# EAGLE design GPS_radiologger_v14 (EAGLE 9.5.1)
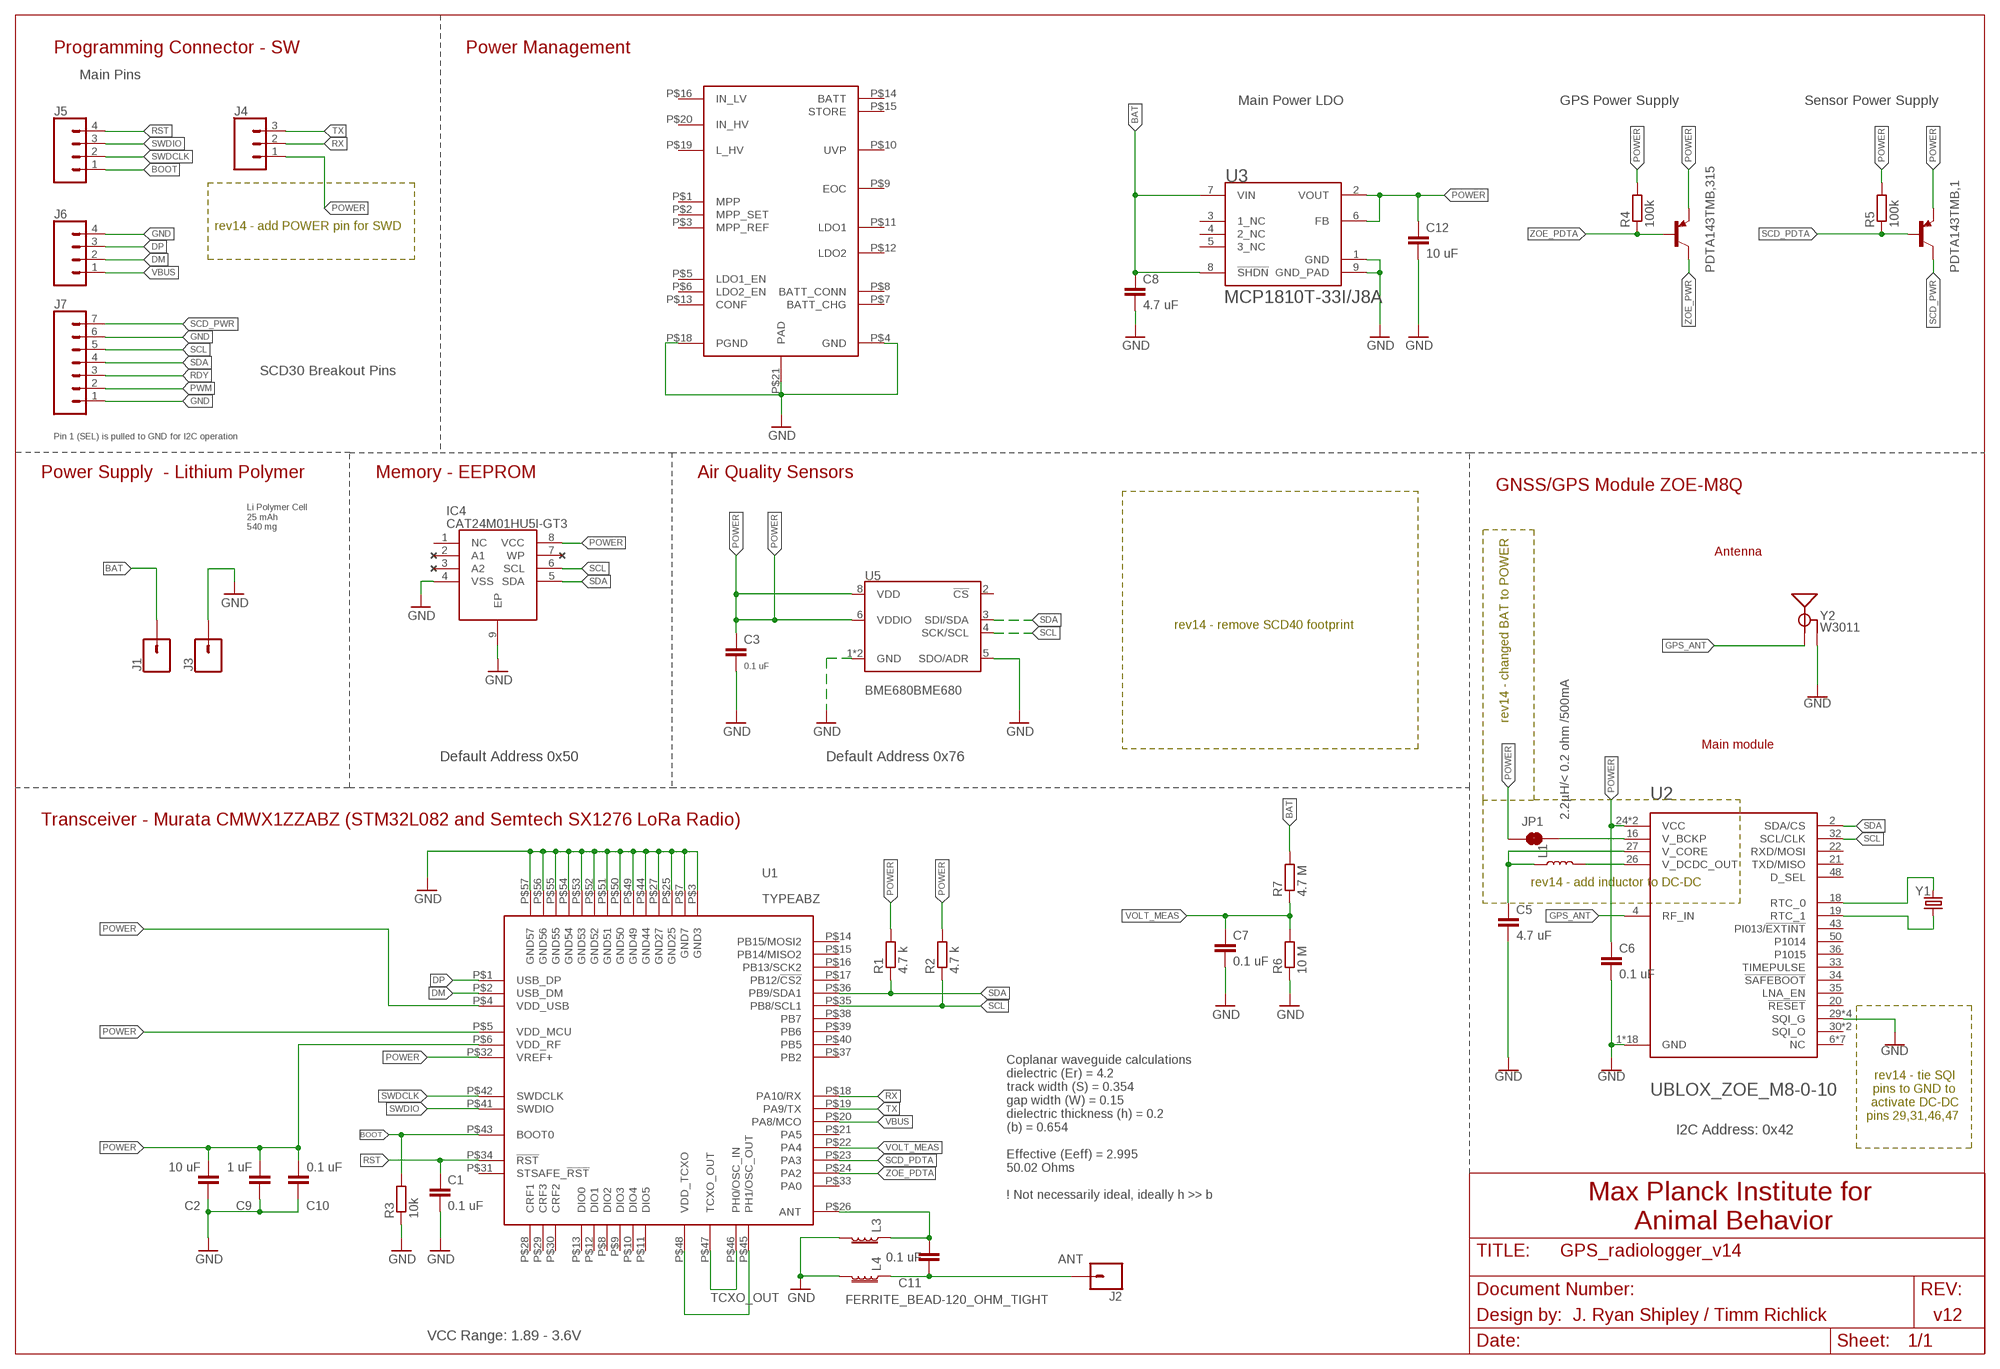
[diagram p0: schematic, sheet 1]

## Parts
C1  0.1 uF  C-EUC0201  [C0201]
C2  10 uF  C-EUC0201  [C0201]
C3  0.1 uF  C-EUC0201  [C0201]
C5  4.7 uF  C-EUC0201  [C0201]
C6  0.1 uF  C-EUC0201  [C0201]
C7  0.1 uF  C-EUC0201  [C0201]
C8  4.7 uF  C-EUC0201  [C0201]
C9  1 uF  C-EUC0201  [C0201]
C10  0.1 uF  C-EUC0201  [C0201]
C11  0.1 uF  C-EUC0201  [C0201]
C12  10 uF  C-EUC0201  [C0201]
IC4  CAT24M01HU5I-GT3  [SON50P300X200X55-9N]
J1  CONN_01PTH_NO_SILK_YES_STOP  [1X01_NO_SILK]
J2  CONN_01PTH_NO_SILK_SMALL  [1X01_SMALL]
J3  CONN_01PTH_NO_SILK_YES_STOP  [1X01_NO_SILK]
J4  CONN_031X03_1.27_NO_SILK  [1X03_1.27MM_NO_SILK]
J5  CONN_041.27MM_NO_SILK  [1X04_1.27MM_NO_SILK]
J6  CONN_041.27MM_NO_SILK  [1X04_1.27MM_NO_SILK]
J7  CONN_07NO_SILK  [1X07_NO_SILK]
JP1  JUMPER-SMT_2_NC_TRACE_NO-SILK  [SMT-JUMPER_2_NC_TRACE_NO-SILK]
L1  2.2µH/< 0.2 ohm /500mA  INDUCTOR-0805-3.3UH  [0805]
L3  FERRITE_BEAD-120_OHM_TIGHT  [0402-TIGHT]
L4  FERRITE_BEAD-120_OHM_TIGHT  [0402-TIGHT]
PDTA143TMB,1  TINYPICO-PNPAMB  [SOT883(B)]
PDTA143TMB,315  TINYPICO-PNPAMB  [SOT883(B)]
R1  4.7 k  R-EU_R0201  [R0201]
R2  4.7 k  R-EU_R0201  [R0201]
R3  10k  R-EU_R0201  [R0201]
R4  100k  R-EU_R0201  [R0201]
R5  100k  R-EU_R0201  [R0201]
R6  10 M  R-EU_R0201  [R0201]
R7  4.7 M  R-EU_R0201  [R0201]
U1  TYPEABZ  [TYPEABZ]
U2  UBLOX_ZOE_M8-0-10  [UBLOX_ZOE_M8-0-10]
U3  MICROCHIP_MCP1810T-33I-J8AMICROCHIP_MCP1810T-33I-J8A_0_0  [MICROCHIP_MCP1810T-33I-J8A_0]
U4  SPV1050  [SPV1050]
U5  BME680BME680  [LGA3.0X3.0]
Y1  32.768kHz  CRYSTAL-32.768KHZ  [CRYSTAL-SMD-1.0X1.2MM]
Y2  W3011  GPS_CHIP_ANTENNAW3011  [W3011]

## Nets
ANT: C11.1 J2.P$1 L4.1
BAT: C8.1 J1.1 R7.2 U3.7(VIN) U3.8(!SHDN!)
BOOT: J5.1 R3.2 U1.P$43(BOOT0)
DM: J6.2 U1.P$2(USB_DM)
DP: J6.3 U1.P$1(USB_DP)
GND: C1.2 C2.1 C3.2 C5.2 C6.2 C7.2 C8.2 C9.1 C10.1 C12.2 IC4.4(VSS) IC4.9(EP) J3.1 J6.4 J7.1 J7.6 L3.2 L4.2 R3.1 R6.1 U1.P$3(GND3) U1.P$7(GND7) U1.P$25(GND25) U1.P$27(GND27) U1.P$44(GND44) U1.P$49(GND49) U1.P$50(GND50) U1.P$51(GND51) U1.P$52(GND52) U1.P$53(GND53) U1.P$54(GND54) U1.P$55(GND55) U1.P$56(GND56) U1.P$57(GND57) U2.1(GND) U2.3(GND) U2.5(GND) U2.7(GND) U2.8(GND) U2.9(GND) U2.10(GND) U2.11(GND) U2.12(GND) U2.17(GND) U2.23(GND) U2.29(SQI_G) U2.31(SQI_G) U2.37(GND) U2.38(GND) U2.39(GND) U2.40(GND) U2.41(GND) U2.44(GND) U2.46(SQI_G) U2.47(SQI_G) U2.49(GND) U3.1(GND) U3.9(GND_PAD) U4.P$4(GND) U4.P$18(PGND) U4.P$21(PAD) U5.1(GND) U5.5(SDO/ADR) U5.7(GND) Y2.2(GND) Y2.3(GND)
GPS_ANT [antenna]: U2.4(RF_IN) Y2.1(SIGNAL)
N$1: U1.P$45(PH1/OSC_OUT) U1.P$48(VDD_TCXO)
N$2: JP1.2 U2.16(V_BCKP)
N$3: C5.1 L1.1 U2.27(V_CORE)
N$5: L1.2 U2.26(V_DCDC_OUT)
N$14: U2.18(RTC_0) Y1.P$2
N$15: U2.19(RTC_1) Y1.P$1
N$32: C11.2 L3.1 U1.P$26(ANT)
POWER: C2.2 C3.1 C6.1 C9.2 C10.2 C12.1 IC4.8(VCC) J4.1 JP1.1 PDTA143TMB,1.2(E) PDTA143TMB,315.2(E) R1.2 R2.2 R4.2 R5.2 U1.P$4(VDD_USB) U1.P$5(VDD_MCU) U1.P$6(VDD_RF) U1.P$32(VREF+) U2.24(VCC) U2.25(VCC) U3.2(VOUT) U3.6(FB) U5.6(VDDIO) U5.8(VDD)
PWM: J7.2
RDY: J7.3
RST: C1.1 J5.4 U1.P$34(!RST)
RX: J4.2 U1.P$18(PA10/RX)
SCD_PDTA: PDTA143TMB,1.1(B) R5.1 U1.P$23(PA3)
SCD_PWR: J7.7 PDTA143TMB,1.3(C)
SCL: IC4.6(SCL) J7.5 R2.1 U1.P$35(PB8/SCL1) U2.32(SCL/CLK) U5.4(SCK/SCL)
SDA: IC4.5(SDA) J7.4 R1.1 U1.P$36(PB9/SDA1) U2.2(SDA/CS) U5.3(SDI/SDA)
SWDCLK: J5.2 U1.P$42(SWDCLK)
SWDIO: J5.3 U1.P$41(SWDIO)
TCXO_OUT: U1.P$46(PH0/OSC_IN) U1.P$47(TCXO_OUT)
TX: J4.3 U1.P$19(PA9/TX)
VBUS: J6.1 U1.P$20(PA8/MCO)
VOLT_MEAS: C7.1 R6.2 R7.1 U1.P$22(PA4)
ZOE_PDTA: PDTA143TMB,315.1(B) R4.1 U1.P$24(PA2)
ZOE_PWR: PDTA143TMB,315.3(C)
Unconnected: IC4.1(NC) IC4.2(A1) IC4.3(A2) IC4.7(WP) U1.P$8(DIO2) U1.P$9(DIO3) U1.P$10(DIO4) U1.P$11(DIO5) U1.P$12(DIO1) U1.P$13(DIO0) U1.P$14(PB15/MOSI2) U1.P$15(PB14/MISO2) U1.P$16(PB13/SCK2) U1.P$17(PB12/!CS2) U1.P$21(PA5) U1.P$28(CRF1) U1.P$29(CRF3) U1.P$30(CRF2) U1.P$31(STSAFE_!RST) U1.P$33(PA0) U1.P$37(PB2) U1.P$38(PB7) U1.P$39(PB6) U1.P$40(PB5) U2.6(NC) U2.13(NC) U2.14(NC) U2.15(NC) U2.20(!RESET) U2.21(TXD/MISO) U2.22(RXD/MOSI) U2.28(NC) U2.30(SQI_O) U2.33(TIMEPULSE) U2.34(!SAFEBOOT) U2.35(LNA_EN) U2.36(P1015) U2.42(NC) U2.43(PI013/!EXTINT) U2.45(SQI_O) U2.48(D_SEL) U2.50(P1014) U2.51(NC) U3.3(1_NC) U3.4(2_NC) U3.5(3_NC) U4.P$1(MPP) U4.P$2(MPP_SET) U4.P$3(MPP_REF) U4.P$5(LDO1_EN) U4.P$6(LDO2_EN) U4.P$7(BATT_CHG) U4.P$8(BATT_CONN) U4.P$9(EOC) U4.P$10(UVP) U4.P$11(LDO1) U4.P$12(LDO2) U4.P$13(CONF) U4.P$14(BATT) U4.P$15(STORE) U5.2(!CS)

## Notes on the sheet
- Programming Connector - SW | Power Management
- Main Pins
- Main Power LDO | GPS Power Supply | Sensor Power Supply
- rev14 - add POWER pin for SWD
- SCD30 Breakout Pins
- Pin 1 (SEL) is pulled to GND for I2C operation
- Power Supply  - Lithium Polymer | Memory - EEPROM | Air Quality Sensors
- GNSS/GPS Module ZOE-M8Q
- Li Polymer Cell
  25 mAh
  540 mg
- Antenna
- rev14 - remove SCD40 footprint
- rev14 - changed BAT to POWER
- Main module
- Default Address 0x50 | Default Address 0x76
- Transceiver - Murata CMWX1ZZABZ (STM32L082 and Semtech SX1276 LoRa Radio)
- rev14 - add inductor to DC-DC
- rev14 - tie SQI 
  pins to GND to 
  activate DC-DC
  pins 29,31,46,47
- I2C Address: 0x42
- Coplanar waveguide calculations
  dielectric (Er) = 4.2
  track width (S) = 0.354
  gap width (W) = 0.15
  dielectric thickness (h) = 0.2
  (b) = 0.654
  
  Effective (Eeff) = 2.995
  50.02 Ohms
  
  ! Not necessarily ideal, ideally h >> b
- Max Planck Institute for 
  Animal Behavior
- Design by: | J. Ryan Shipley / Timm Richlick | v12
- VCC Range: 1.89 - 3.6V

## Power pins joined to a net without a drawn wire
IN_HV: U4.P$20(IN_HV)
IN_LV: U4.P$16(IN_LV)
L_HV: U4.P$19(L_HV)

## Library data of the parts
C1-C3 C5-C12 = rcl:C-EU: CAPACITOR, European symbol; SPICEPREFIX: C
IC4 = CAT24M01HU5I-GT3-CorrectedV2:CAT24M01HU5I-GT3: EEPROM 1MB I2C SERIAL EEPROM Source: Datasheet <http://www.onsemi.com/pub/Collateral/CAT24M01-D.PDF>; ALLIED_NUMBER: 70300250; ALLIED_PRICE-STOCK: http://www.alliedelec.com/on-semiconductor-cat24m01hu5i-gt3/70300250/; DESCRIPTION: EEPROM 1MB I2C SERIAL EEPROM; HEIGHT: 0.55mm; MANUFACTURER_NAME: ON Semiconductor; MANUFACTURER_PART_NUMBER: CAT24M01HU5I-GT3; MOUSER_PART_NUMBER: 863-CAT24M01HU5I-GT3; MOUSER_PRICE-STOCK: https://www.mouser.com/Search/Refine.aspx?Keyword=863-CAT24M01HU5I-GT3; RS_PART_NUMBER: 7814831P; RS_PRICE-STOCK: http://uk.rs-online.com/web/p/products/7814831P
J1-J3 = SparkFun-Connectors:CONN_01: Single connection point. Often used as Generic Header-pin footprint for 0.1 inch spaced/style header connections On any of the 0.1 inch spaced packages, you can populate with these: Break Away Headers - Straight <https://www.sparkfun.com/products/116> (PRT-00116) Break Away Male Headers - Right Angle <https://www.sparkfun.com/products/553> (PRT-00553) Female Headers <https://www.sparkfun.com/products/115> (PRT-00115) Break Away Headers - Machine Pin <https://www.sparkfun.com/products/117> (PRT-00117) Break Away Female Headers - Swiss Machine Pin <https://www.sparkfun.com/products/743> (PRT-00743) This device is also useful as a general connection point to wire up your design to another part of your project. Our various solder wires solder well into these plated through hole pads. Hook-Up Wire - Assortment (Stranded, 22 AWG) <https://www.sparkfun.com/products/11375> (PRT-11375) Hook-Up Wire - Assortment (Solid Core, 22 AWG) <https://www.sparkfun.com/products/11367> (PRT-11367) View the entire wire category on our website here <https://www.sparkfun.com/categories/141> Special notes: SMTSO-256-ET is a "flush mount" nut for a 4-40 screw. We mostly use this on specialty testbeds; it is a nice way to connect hardware to your PCB at an adjustable hieght. Also note, the SNAP packages are for using a snappable style connector. We sell a baggie of snaps and they are also used on two LilyPad designs: Snap Assortment - 30 pack (male and female) <https://www.sparkfun.com/products/11347> (DEV-11347) LilyPad Arduino SimpleSnap <https://www.sparkfun.com/products/10941> (DEV-10941) LilyPad SimpleSnap Protoboard <https://www.sparkfun.com/products/10940> (DEV-10940)
J4 = SparkFun-Connectors:CONN_03: Multi connection point. Often used as Generic Header-pin footprint for 0.1 inch spaced/style header connections On any of the 0.1 inch spaced packages, you can populate with these: Break Away Headers - Straight <https://www.sparkfun.com/products/116> (PRT-00116) Break Away Male Headers - Right Angle <https://www.sparkfun.com/products/553> (PRT-00553) Female Headers <https://www.sparkfun.com/products/115> (PRT-00115) Break Away Headers - Machine Pin <https://www.sparkfun.com/products/117> (PRT-00117) Break Away Female Headers - Swiss Machine Pin <https://www.sparkfun.com/products/743> (PRT-00743) Stackable Header - 3 Pin (Female, 0.1") <https://www.sparkfun.com/products/13875> (PRT-13875) For SCREWTERMINALS and SPRING TERMINALS visit here: Screw Terimnals on SparkFun.com <https://www.sparkfun.com/search/results?term=Screw+Terminals> (5mm/3.5mm/2.54mm spacing) This device is also useful as a general connection point to wire up your design to another part of your project. Our various solder wires solder well into these plated through hole pads. Hook-Up Wire - Assortment (Stranded, 22 AWG) <https://www.sparkfun.com/products/11375> (PRT-11375) Hook-Up Wire - Assortment (Solid Core, 22 AWG) <https://www.sparkfun.com/products/11367> (PRT-11367) View the entire wire category on our website here <https://www.sparkfun.com/categories/141> Special notes: Molex polarized connector foot print use with SKU : PRT-08232 with associated crimp pins and housings.
J5 J6 = SparkFun-Connectors:CONN_04: Multi connection point. Often used as Generic Header-pin footprint for 0.1 inch spaced/style header connections On any of the 0.1 inch spaced packages, you can populate with these: Break Away Headers - Straight <https://www.sparkfun.com/products/116> (PRT-00116) Break Away Male Headers - Right Angle <https://www.sparkfun.com/products/553> (PRT-00553) Female Headers <https://www.sparkfun.com/products/115> (PRT-00115) Break Away Headers - Machine Pin <https://www.sparkfun.com/products/117> (PRT-00117) Break Away Female Headers - Swiss Machine Pin <https://www.sparkfun.com/products/743> (PRT-00743) For SCREWTERMINALS and SPRING TERMINALS visit here: Screw Terimnals on SparkFun.com <https://www.sparkfun.com/search/results?term=Screw+Terminals> (5mm/3.5mm/2.54mm spacing) This device is also useful as a general connection point to wire up your design to another part of your project. Our various solder wires solder well into these plated through hole pads. Hook-Up Wire - Assortment (Stranded, 22 AWG) <https://www.sparkfun.com/products/11375> (PRT-11375) Hook-Up Wire - Assortment (Solid Core, 22 AWG) <https://www.sparkfun.com/products/11367> (PRT-11367) View the entire wire category on our website here <https://www.sparkfun.com/categories/141> Special notes: Molex polarized connector foot print use with SKU : PRT-08231 with associated crimp pins and housings. 1MM SMD Version SKU: PRT-10208
J7 = SparkFun-Connectors:CONN_07: Multi connection point. Often used as Generic Header-pin footprint for 0.1 inch spaced/style header connections On any of the 0.1 inch spaced packages, you can populate with these: Break Away Headers - Straight <https://www.sparkfun.com/products/116> (PRT-00116) Break Away Male Headers - Right Angle <https://www.sparkfun.com/products/553> (PRT-00553) Female Headers <https://www.sparkfun.com/products/115> (PRT-00115) Break Away Headers - Machine Pin <https://www.sparkfun.com/products/117> (PRT-00117) Break Away Female Headers - Swiss Machine Pin <https://www.sparkfun.com/products/743> (PRT-00743) For SCREWTERMINALS and SPRING TERMINALS visit here: Screw Terimnals on SparkFun.com <https://www.sparkfun.com/search/results?term=Screw+Terminals> (5mm/3.5mm/2.54mm spacing) This device is also useful as a general connection point to wire up your design to another part of your project. Our various solder wires solder well into these plated through hole pads. Hook-Up Wire - Assortment (Stranded, 22 AWG) <https://www.sparkfun.com/products/11375> (PRT-11375) Hook-Up Wire - Assortment (Solid Core, 22 AWG) <https://www.sparkfun.com/products/11367> (PRT-11367) View the entire wire category on our website here <https://www.sparkfun.com/categories/141> Special notes: Molex polarized connector foot print use with SKU : PRT-08231 with associated crimp pins and housings. 1MM SMD Version SKU: PRT-10208 NOTES ON THE VARIANTS LOCK and LOCK_LONGPADS... This footprint was designed to help hold the alignment of a through-hole component (i.e. 6-pin header) while soldering it into place. You may notice that each hole has been shifted either up or down by 0.005 of an inch from it's more standard position (which is a perfectly straight line). This slight alteration caused the pins (the squares in the middle) to touch the edges of the holes. Because they are alternating, it causes a "brace" to hold the component in place. 0.005 has proven to be the perfect amount of "off-center" position when using our standard breakaway headers. Although looks a little odd when you look at the bare footprint, once you have a header in there, the alteration is very hard to notice. Also,if you push a header all the way into place, it is covered up entirely on the bottom side.
JP1 = SparkFun-Jumpers:JUMPER-SMT_2_NC_TRACE: Normally closed trace jumper This jumper has a trace between two pads so it's normally closed (NC). Use a razor knife to open the connection. For best results follow the IPC guidelines for cutting traces: Cutout at least 0.063 mm (0.005 in). Remove all loose material to clean up the cut area. Seal the cut with an approved epoxy. Reapply solder to reclose the connection.
L1 = SparkFun-Coils:INDUCTOR: Inductors Resist changes in electrical current. Basically a coil of wire. SparkFun Products: SparkFun Load Cell Amplifier - HX711 <https://www.sparkfun.com/products/13879> IOIO-OTG - V2.2 <https://www.sparkfun.com/products/13613>; PROD_ID: NDUC-13076; VALUE: 3.3µH/±20%/450mA
L3 L4 = SparkFun-Coils:FERRITE_BEAD-120_OHM_TIGHT
PDTA143TMB,1 PDTA143TMB,315 = UnexpectedMaker:TINYPICO-PNP: PNP general purpose transistors AAL Eindhoven MK
R1-R7 = rcl:R-EU_: RESISTOR, European symbol; SPICEPREFIX: R
U1 = Kris:TYPEABZ: CMWX1ZZABZ-078
U2 = SparkFun-GPS:UBLOX_ZOE_M8-0-10: UBLOX ZOE-M8Q-0-10 u-blox ZOE-M8 standard precision GNSS SiP (System in Package) modules feature the high performance u-blox M8 GNSS engine. ZOE-M8’s ultra-miniature form factor integrates a complete GNSS receiver including SAW filter, LNA and TCXO. Handles all GNSS systems and can simulatenously use up to three of them, with accuracy ranging from 2.5m to 4m. GPS GLONASS BeiDou Galileo This can be corrected with the SBAS or QZSS augmentation systems.; PROD_ID: IC-14251
U3 = MCP1810:MICROCHIP_MCP1810T-33I-J8A: Ultra-Low Quiescent Current LDO Regulator; CENTROID_NOT_SPECIFIED: No; DATASHEET: http://ww1.microchip.com/downloads/en/DeviceDoc/20005623A.pdf; DIGIKEY_DESCRIPTION: IC REG LINEAR 150MA 8-VDFN; DIGIKEY_PART_NUMBER: MCP1810T-33I/J8ACT-ND; IPC_LAND_PATTERN_NAME: DFN200X200X85-8; LEAD_FREE: yes; MF: Microchip; MFG_PACKAGE_IDENT: C04-3207A; MOUSER_PART_NUMBER: 579-MCP1810T-33I/J8A; MPN: MCP1810T-33I/J8A; PACKAGE: VDFN8; PREFIX: U; ROHS: yes; TEMPERATURE_RANGE_HIGH: +85°C; TEMPERATURE_RANGE_LOW: -40°C
U4 = STM-SPV1050_V2:SPV1050
U5 = SparkFun-Sensors:BME680: Bosch BME680 – Combined Humidity and Pressure Sensor The BME680 is as combined digital humidity, pressure and temperature sensor based on proven sensing principles. The sensor module is housed in an extremely compact metal-lid LGA package with a footprint of only 3.0×3.0mm with a height of 0.93mm. Its small dimensions and its low power consumption allow the implementation in battery driven devices such as handsets, GPS modules or watches.; PROD_ID: IC-14656
Y1 = SparkFun-Clocks:CRYSTAL-32.768KHZ: 32.768kHz Crystal Frequency: 32.768kHz Frequency Stability: ±20ppm Load Capacitance: 12.5pF (PTH-2X6 & SMD-3.2X1.5), 6pF (SMD-2X6) SparkFun Products: SparkFun BigTime Watch Kit <https://www.sparkfun.com/products/11734> SparkFun nRF52832 Breakout <https://www.sparkfun.com/products/13990> SparkFun Real Time Clock Module <https://www.sparkfun.com/products/12708>; XTAL: SC12S-7PF20PPM
Y2 = SparkFun-GPS:GPS_CHIP_ANTENNA; PROD_ID: ANT-14304

## Net classes
1 vcc: width 0 mm

## Board
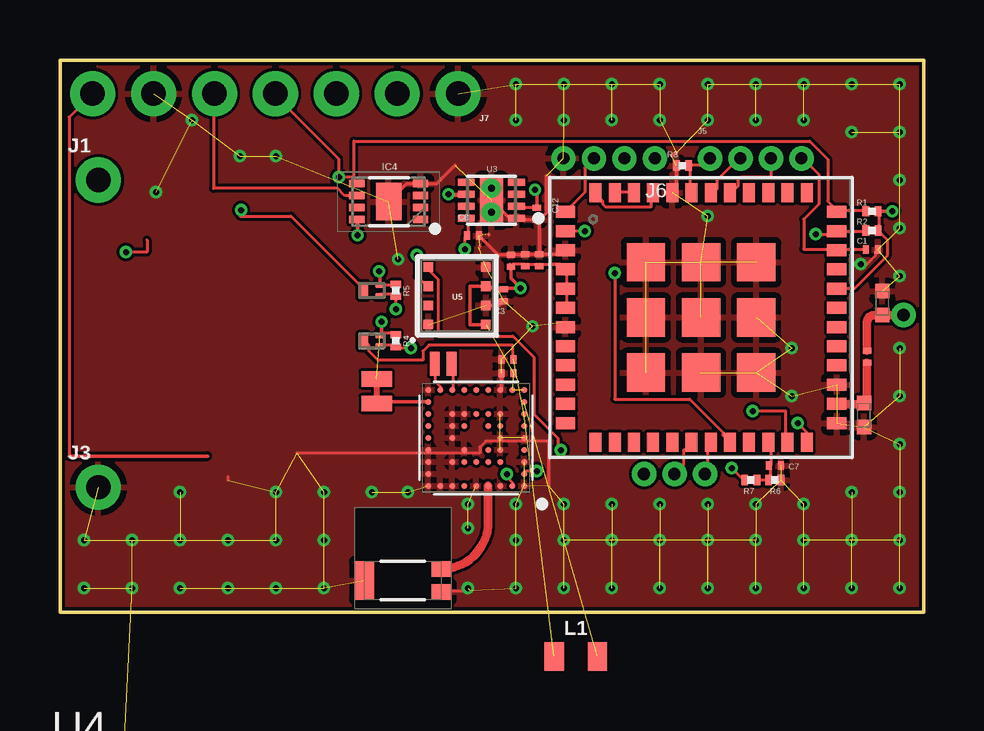
[diagram p1: board, top side]
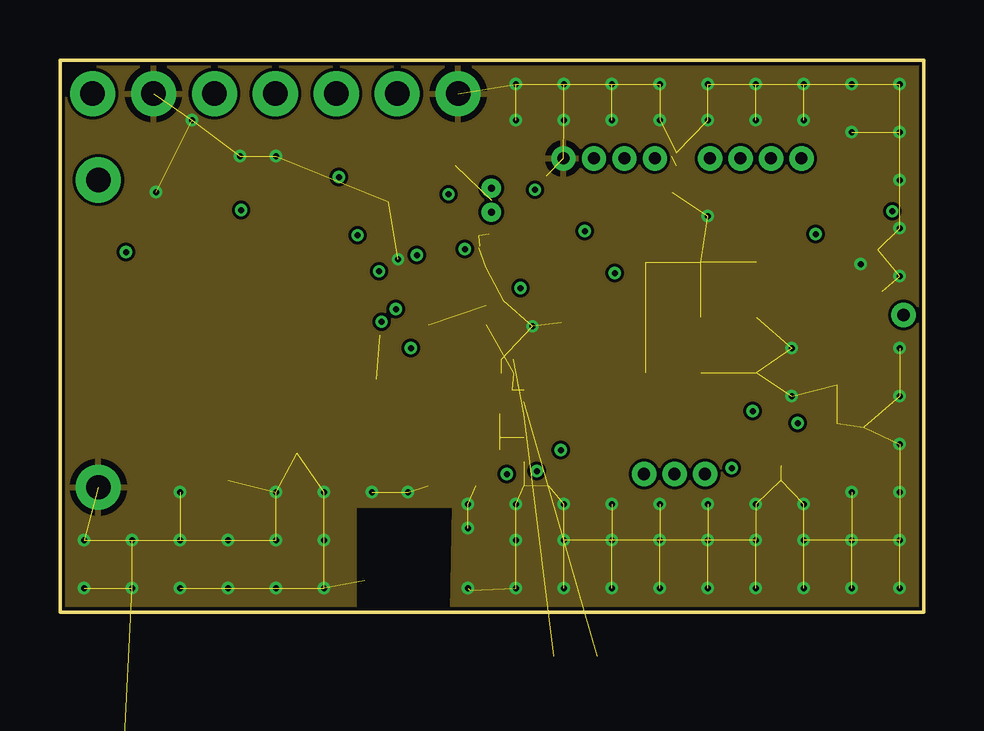
[diagram p2: board, inner layer Route2]
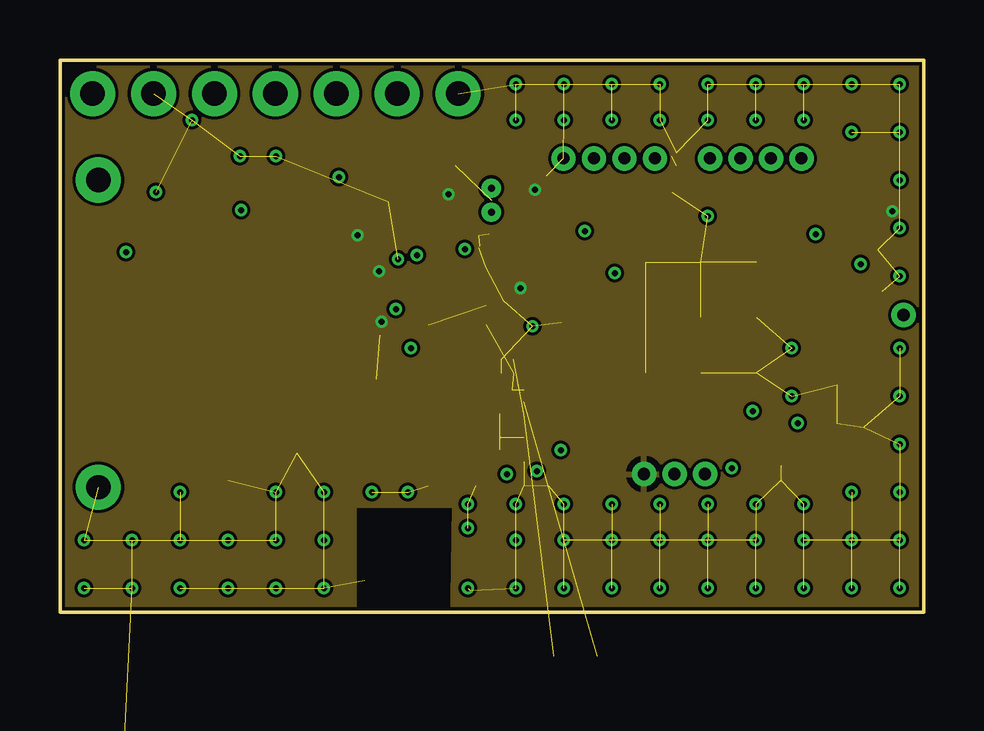
[diagram p3: board, inner layer Route15]
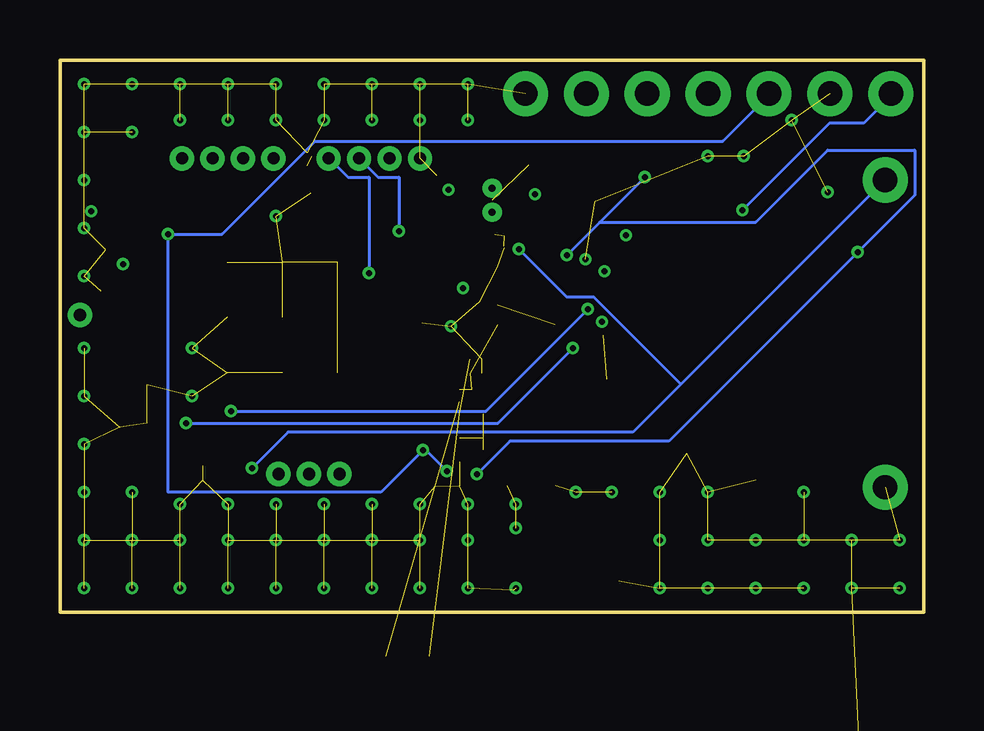
[diagram p4: board, bottom side, seen from below]

Size 36 x 23 mm. Coordinates in mm from the lower left corner, seen from the top.
Outline: 0,0 0,23 36,23 36,0 0,0
Copper layers (1+2*15+16): Top 0.035mm / dielectric 0.2mm / Route2 0.035mm / dielectric 0.23mm / Route15 0.035mm / dielectric 0.2mm / Bottom 0.035mm
Design rules "default *": minimum track width 5mil, minimum drill 0.25mm, track to track 5mil, track to pad 5mil, pad to pad 5mil, via to via 5mil, smd to smd 5mil, copper to edge 5mil, drill to drill 3mil, minimum pad ring 10mil, minimum via ring 5mil, stop-mask expansion 4mil, vias tented up to drill 0mil, thermal gap 10mil

### Footprints (pad centres in the part's own frame; a part is rotated, then mirrored left to right if it is on the bottom)
C0201 = smd 0.25 x 0.35: 1 -0.25,0; 2 0.25,0
SON50P300X200X55-9N = smd 0.63 x 0.32: 1 -1.33,0.75; 2 -1.33,0.25; 3 -1.33,-0.25; 4 -1.33,-0.75; 5 1.33,-0.75; 6 1.33,-0.25; 7 1.33,0.25; 8 1.33,0.75 | smd 1.06 x 1.56: 9 0,0
1X01_NO_SILK = drill 1.016 pad 1.88: 1 0,0
1X01_SMALL = drill 0.508: P$1 0,0
1X03_1.27MM_NO_SILK = drill 0.508 pad 1: 1 0,0; 2 1.27,0; 3 2.54,0
1X04_1.27MM_NO_SILK = drill 0.508 pad 1: 1 0,0; 2 1.27,0; 3 2.54,0; 4 3.81,0
1X07_NO_SILK = drill 1.016 pad 1.88: 1 0,0; 2 2.54,0; 3 5.08,0; 4 7.62,0; 5 10.16,0; 6 12.7,0; 7 15.24,0
SMT-JUMPER_2_NC_TRACE_NO-SILK = smd 0.635 x 1.27: 1 -0.508,0; 2 0.508,0
0805 = smd 0.8 x 1.2: 1 -0.9,0; 2 0.9,0
0402-TIGHT = smd 0.6 x 0.6: 1 -0.5,0; 2 0.5,0
SOT883(B) = smd 0.4 x 0.25: 1 -0.35,0.225; 2 -0.35,-0.225 | smd 0.4 x 0.7: 3 0.35,0
R0201 = smd 0.28 x 0.43: 1 -0.255,0; 2 0.255,0
TYPEABZ = smd 0.8 x 0.5: P$1 -5.65,4.4; P$2 -5.65,3.6; P$3 -5.65,2.8; P$4 -5.65,2; P$5 -5.65,1.2; P$6 -5.65,0.4; P$7 -5.65,-0.4; P$8 -5.65,-1.2; P$9 -5.65,-2; P$10 -5.65,-2.8; P$11 -5.65,-3.6; P$12 -5.65,-4.4; P$25 5.65,-4.4; P$26 5.65,-3.6; P$27 5.65,-2.8; P$28 5.65,-2; P$29 5.65,-1.2; P$30 5.65,-0.4; P$31 5.65,0.4; P$32 5.65,1.2; P$33 5.65,2; P$34 5.65,2.8; P$35 5.65,3.6; P$36 5.65,4.4 | smd 0.5 x 0.8: P$13 -4.4,-5.2; P$14 -3.6,-5.2; P$15 -2.8,-5.2; P$16 -2,-5.2; P$17 -1.2,-5.2; P$18 -0.4,-5.2; P$19 0.4,-5.2; P$20 1.2,-5.2; P$21 2,-5.2; P$22 2.8,-5.2; P$23 3.6,-5.2; P$24 4.4,-5.2; P$37 4.4,5.2; P$38 3.6,5.2; P$39 2.8,5.2; P$40 2,5.2; P$41 1.2,5.2; P$42 0.4,5.2; P$43 -0.4,5.2; P$44 -1.2,5.2; P$45 -2,5.2; P$46 -2.8,5.2; P$47 -3.6,5.2; P$48 -4.4,5.2 | smd 1.6 x 1.6: P$49 -2.3,2.3; P$50 0,2.3; P$51 2.3,2.3; P$52 -2.3,0; P$53 0,0; P$54 2.3,0; P$55 -2.3,-2.3; P$56 0,-2.3; P$57 2.3,-2.3
UBLOX_ZOE_M8-0-10 = smd 0.25 x 0.25: 1 -1.996,2.004; 2 -1.496,2.004; 3 -0.996,2.004; 4 -0.496,2.004; 5 0.004,2.004; 6 0.504,2.004; 7 1.004,2.004; 8 1.504,2.004; 9 2.004,2.004; 10 2.004,1.504; 11 2.004,1.004; 12 2.004,0.504; 13 2.004,0.004; 14 2.004,-0.496; 15 2.004,-0.996; 16 2.004,-1.496; 17 2.004,-1.996; 18 1.504,-1.996; 19 1.004,-1.996; 20 0.504,-1.996; 21 0.004,-1.996; 22 -0.496,-1.996; 23 -0.996,-1.996; 24 -1.496,-1.996; 25 -1.996,-1.996; 26 -1.996,-1.496; 27 -1.996,-0.996; 28 -1.996,-0.496; 29 -1.996,0.004; 30 -1.996,0.504; 31 -1.996,1.004; 32 -1.996,1.504; 33 -0.996,1.004; 34 -0.496,1.004; 35 0.004,1.004; 36 0.504,1.004; 37 1.004,1.004; 38 1.004,0.004; 39 1.004,-0.496; 40 1.004,-0.996; 41 0.504,-0.996; 42 0.004,-0.996; 43 -0.496,-0.996; 44 -0.996,-0.996; 45 -0.996,-0.496; 46 -0.996,0.004; 47 -0.996,0.504; 48 -0.496,0.504; 49 0.504,0.504; 50 0.504,-0.496; 51 -0.496,-0.496
MICROCHIP_MCP1810T-33I-J8A_0 = smd 0.7 x 0.3: 1 -1.05,0.75; 2 -1.05,0.25; 3 -1.05,-0.25; 4 -1.05,-0.75; 5 1.05,-0.75; 6 1.05,-0.25; 7 1.05,0.25; 8 1.05,0.75 | smd 0.95 x 1.95: 9 0,0 | drill 0.3 pad 0.6: PAD_1 0,0.5; PAD_2 0,-0.5
SPV1050 = smd 0.7 x 0.2: P$1 -1.35,0.8; P$2 -1.35,0.4; P$3 -1.35,0; P$4 -1.35,-0.4; P$5 -1.35,-0.8; P$11 1.35,-0.8; P$12 1.35,-0.4; P$13 1.35,0; P$14 1.35,0.4; P$15 1.35,0.8 | smd 0.2 x 0.7: P$6 -0.8,-1.35; P$7 -0.4,-1.35; P$8 0,-1.35; P$9 0.4,-1.35; P$10 0.8,-1.35; P$16 0.8,1.35; P$17 0.4,1.35; P$18 0,1.35; P$19 -0.4,1.35; P$20 -0.8,1.35 | smd 1.6 x 1.6: P$21 0,0
LGA3.0X3.0 = smd 0.4 x 0.4: 1 1.2,1.2; 2 1.2,0.4; 3 1.2,-0.4; 4 1.2,-1.2; 5 -1.2,-1.2; 6 -1.2,-0.4; 7 -1.2,0.4; 8 -1.2,1.2
CRYSTAL-SMD-1.0X1.2MM = smd 0.4 x 1: P$1 0.35,0; P$2 -0.35,0
W3011 = smd 0.8 x 0.65: 1 1.6,0.475; 2 1.6,-0.475 | smd 0.8 x 1.6: 3 -1.6,0

### Placement (x,y rotation side)
C1  33.85,15.1 0 top
C2  18.8,14.64 270 top
C3  18.5,13.2 270 top
C5  18.65,10.53 180 top
C6  18.65,9.95 180 top
C7  29.8,6.1 0 top
C8  17.22,15.68 0 top
C9  19.4,14.65 270 top
C10  19.98,14.65 270 top
C11  33.64,10.64 270 top
C12  19.88,16.6 270 top
IC4  13.7,17.1 180 top
J1  1.6,18 0 top
J2  35.16,12.38 0 top
J3  1.6,5.2 0 top
J4  24.35,5.75 0 top
J5  27.1,18.9 0 top
J6  24.8,18.9 180 top
J7  16.6,21.6 180 top
JP1  13.2,9.2 270 top
L1  21.5,-1.85 0 top
L3  33.51,8.21 270 top
L4  34.28,12.87 90 top
PDTA143TMB,1  13,13.4 180 top
PDTA143TMB,315  13,11.3 180 top
R1  33.85,16.7 0 top
R2  33.85,15.9 0 top
R3  25.95,18.6 0 top
R4  14,11.3 90 top
R5  14,13.4 90 top
R6  29.8,5.5 180 top
R7  28.8,5.5 180 top
U1  26.73,12.27 0 top
U2  17.35,7.25 180 top
U3  17.99,17.16 180 top
U4  2.65,-7.4 0 top  (outside the outline)
U5  16.56,13.17 180 top
Y1  15.97,10.34 0 top
Y2  14.29,1.31 0 top

### Tracks (layer width: path | path; a pad name or v marks a point on that pad's centre or on a via)
ANT
  Top 0.127: C11.1
  Top 0.152: 33.96,12.38 J2.P$1 | L4.1
  Top 0.354: C11.1 33.64,12.06 arc-90 33.96,12.38 | L4.1 J2.P$1
BAT  (via drill 0.25)
  Top 0.127: U3.7 17,16.88 17,16.5 U3.8 17,16.38 17,15.75 C8.1 16.88,15.62 v16.88,15.12 | v28,6 28.5,5.5 R7.2
  Bottom 0.127: v28,6 26.5,7.5 12.12,7.5 10.12,9.5 | 10.12,9.5 1.62,18 J1.1 | v16.88,15.12 14.88,13.12 13.75,13.12 10.12,9.5
BOOT
  Top 0.127: J5.1 27,18.88 27,18.62 26.25,18.62 R3.2 26.25,18.5 26.25,17.5 U1.P$43
DM  (via drill 0.25)
  Top 0.127: v21.88,15.88 21.12,15.88 U1.P$2
  Bottom 0.127: v21.88,15.88 21.88,18.12 22.75,18.12 23.5,18.88 J6.2
DP
  Top 0.127: U1.P$1 21.12,16.75 21.88,17.5 21.88,18.5 22.25,18.88 J6.3
GND  (via drill 0.25)  (122 unrouted)
  Top 0.127: 17.88,12.75 U5.7 | 9.88,6.62 17.5,6.62 17.5,6.88 17.75,7.12 20.38,7.12 20.38,5.25 | v33.38,14.5 33.62,14.5 34,14.88 34,15 C1.2 | 17.5,15.25 17.47,15.18 | Y2.2 16,0.88 17,0.88 17.1,0.9 | 17.88,15.75 17.88,15.68 | 25.5,19 25.7,19.14 | 7,5.5 7,5.65
  Top 0.152: U3.9 18.74,16.41 U3.1 19.09,16.35 C12.2 19.96,16.27 | 19.96,16.27 19.98,16.25 C10.1 | U1.P$3 20.91,14.9 C10.1 | C10.1 C9.1 19.39,14.89 C2.1 18.26,14.89 C8.2 | 20.9,12.05 U1.P$7 | IC4.9 14.45,17.85 IC4.4 15.7,17.85 16.46,18.61 | 19.96,16.27 19.96,16.33 20.27,16.64 20.27,18.18 | R3.1 25.7,17.64 U1.P$44 | C6.2 18.4,9.3 U2.23 | U5.7 18.32,12.77 C3.2
  other vias: 3,1 1,1 5,1 7,1 9,1 11,1 17,1 19,1 21,1 23,1 25,1 27,1 29,1 31,1 33,1 35,1 35,3 35,5 35,7 35,9 35,11 35,16 35,18 35,20 33,22 35,22 31,22 29,22 27,22 25,22 23,22 21,22 19,22 19,3 21,3 11,3 9,3 7,3 5,3 3,3 1,3 5,5 9,5 13,5 11,5 35,14 23,3 25,3 27,3 29,3 31,3 33,3 33,5 33,20 27,20.5 29,20.5 31,20.5 25,20.5 23,20.5 21,20.5 19,20.5 30.5,9 30.5,11 27,16.5 29,4.5 31,4.5 27,4.5 25,4.5 23,4.5 21,4.5 19,4.5 17,4.5 17,3.5 14.5,5 19.7,11.9 14.1,14.7 7.5,19 9,19 5.5,20.5 4,17.5
  pour Route2: -1,23.6 36.9,23.6 36.9,-1.1 16.3,-1.1 16.4,4.4 12.3,4.4 12.3,-1.01 -1,-0.99
  pour Top: -0.4,23.2 36.5,23.2 36.5,-0.4 16.4,-0.4 16.4,4.4 12.3,4.4 12.3,-0.4 -0.4,-0.4
GPS_ANT
  Top 0.127: U2.4
  Top 0.354: U2.4 17.85,3.74 arc-90 Y2.1
N$1
  Top 0.127: U1.P$48 22.38,17.38 22.62,17.12 22.62,17 22.75,16.88 24.62,16.88 24.62,17.38 U1.P$45
N$2
  Top 0.152: U2.16 13.2,8.75 JP1.2
N$3  (2 unrouted)
N$5  (1 unrouted)
N$14
  Top 0.127: U2.18 15.88,9.38 15.62,9.62 15.62,10.25 Y1.P$2
N$15
  Top 0.127: U2.19 16.38,9.38 16.38,10.25 Y1.P$1
N$32
  Top 0.127: 33.62,10.39 C11.2 | 33.62,8.75 L3.1
  Top 0.354: 33.62,8.75 33.62,10.39 | U1.P$26 32.4,8.65 33.46,8.65 L3.1
POWER  (via drill 0.25)  (4 unrouted)
  Top 0.127: PDTA143TMB,315.2 13.38,11.62 14,11.62 R4.2 | R5.2 14,13.62 PDTA143TMB,1.2 13.25,13.62 | 12.38,16.25 IC4.8 | 17.88,12.12 17.88,12 U5.8 | 17.88,13.62 U5.6 | 18.75,14.5 C2.2 18.88,14.5 19.38,14.5 C9.2 19.5,14.5 19.88,14.5 C10.2 20,14.5 20.38,14.5 | 16.38,17.38 16.88,17.38 U3.6 | R1.2 34.12,16.62 34.12,16 R2.2 34.12,15.88 34.5,15.5 34.5,14.88 33.12,13.5 32.5,13.5 U1.P$32 32.38,13.5 | C12.1 19.88,16.88 19.12,16.88 U3.2 | 21,12.62 U1.P$6 21.12,12.75 21.12,13.38 U1.P$5 21.12,13.5 21.12,14.12 | 21.12,14.12 21.12,14.25 U1.P$4 21.12,14.12
  Top 0.152: U5.8 17.1,11.97 17.1,13.57 U5.6 | 16.38,17.38 | v34.7,16.7 R1.2 | 20.38,14.5 20.85,14.5 U1.P$4 | C12.1 19.88,17.6 v19.8,17.6 | C2.2 18.8,13.9 v19.2,13.5 18.55,13.5 C3.1 18.05,13.45 17.88,13.62 | IC4.8 12.4,16.32 v12.4,15.7 | v13.3,14.2 13.3,14 13.35,13.95 PDTA143TMB,1.2 | v13.4,12.1 13.4,11.65 13.38,11.62 | v16.2,17.4 U3.6
  pour Route15: -1.2,23.4 36.7,23.4 36.7,-0.7 16.32,-0.7 16.4,4.4 12.3,4.4 12.3,-0.7 -1.2,-0.7
RST
  Top 0.127: C1.1 33.5,15.12 32.5,15.12 U1.P$34 32.38,15.12 31,15.12 31,16.38 31.62,17 31.62,18.25 31,18.88 J5.4
RX
  Top 0.127: U1.P$18 26.25,7 26,6.75 26,6.12 J4.2
SCD_PDTA  (via drill 0.25)
  Top 0.127: PDTA143TMB,1.1 13.38,13.25 14,13.25 R5.1 v14,12.62 | v28.88,8.38 30.25,8.38 30.25,7.12 U1.P$23
  Bottom 0.127: v14,12.62 18.25,8.38 v28.88,8.38
SCD_PWR  (via drill 0.25)
  Top 0.127: 7.5,16.5 7.6,16.5 | 7.6,16.5 9.62,16.5 12.62,13.5 PDTA143TMB,1.3 | 0.38,6.5 0.38,20.62 1.25,21.5 J7.7 | 7.6,16.5 7.55,16.55 v7.55,16.75
  Top 0.152: 0.38,6.5 6.15,6.5
  Bottom 0.127: v7.55,16.75 3.92,20.38 2.5,20.38 1.38,21.5 J7.7
SCL  (via drill 0.25)
  Top 0.127: IC4.6 11.87,17.35 11.57,17.65 6.4,17.65 6.4,21.56 J7.5 | R2.1 33.5,15.88 32.5,15.88 U1.P$35 32.38,15.75 v31.5,15.75 | v19.88,5.88 19.38,5.88 U2.32 | v20.88,6.75 20.75,6.88 20.75,7.25 19.75,8.25 19.75,10.62 18.88,11.5 15.75,11.5 15.75,13.88 15.38,14.25 U5.4
  Bottom 0.127: v19.88,5.88 20.75,6.75 v20.88,6.75 22.62,5 31.5,5 v31.5,15.75 29.25,15.75 25.38,19.62 8.38,19.62 6.5,21.5 J7.5
SDA  (via drill 0.25)
  Top 0.127: v18.62,5.75 18.62,5.62 18.88,5.38 U2.2 | v2.75,15 3.62,15 3.62,15.5 | R1.1 33.5,16.75 32.5,16.75 U1.P$36 32.38,16.75 32,17.12 32,18.88 31.25,19.62 12.25,19.62 12.25,18.12 | v14.88,14.88 14.88,14 15.25,13.62 U5.3 | 12.25,18.12 v11.62,18.12 11.62,18.88 9,21.5 J7.4 | 12.25,18.12 12.25,17.88 IC4.5
  Bottom 0.127: v18.62,5.75 17.25,7.12 10.62,7.12 v2.75,15 0.38,17.38 0.38,19.25 4,19.25 7,16.25 13.5,16.25 | v11.62,18.12 13.5,16.25 | 13.5,16.25 v14.88,14.88
SWDCLK
  Top 0.127: U1.P$42 27.25,17.5 27.38,17.62 27.38,18 28.25,18.88 J5.2
SWDIO
  Top 0.127: U1.P$41 28,17.5 28.25,17.75 28.25,18 28.38,18.12 29.62,18.12 29.62,18.88 J5.3
TCXO_OUT
  Top 0.127: U1.P$47 23.25,17.5 23.88,17.5 U1.P$46
TX
  Top 0.127: U1.P$19 27.12,7 27,6.88 27,5.75 J4.3
VBUS  (via drill 0.25)
  Top 0.127: v23.12,14.12 23.12,8.88 26.25,8.88 27.62,7.5 27.62,7.38 27.88,7.12 U1.P$20
  Bottom 0.127: v23.12,14.12 23.12,18.12 24,18.12 24.75,18.88 J6.1
VOLT_MEAS
  Top 0.127: R7.1 R6.2 29.62,5.5 29.62,6 C7.1 29.62,6.12 29.62,7 U1.P$22
ZOE_PDTA  (via drill 0.25)
  Top 0.127: PDTA143TMB,315.1 13.38,11.12 14,11.12 R4.1 14,11 v14.62,11 | v30.75,7.88 31.12,7.5 31.12,7.12 U1.P$24
  Bottom 0.127: v14.62,11 17.75,7.88 v30.75,7.88
ZOE_PWR
  Top 0.127: 18.88,10.62 18.88,11.12 15.38,11.12 15.12,10.88 15.12,10.5 13.25,10.5 12.88,10.88 12.88,11.12 12.75,11.25 PDTA143TMB,315.3